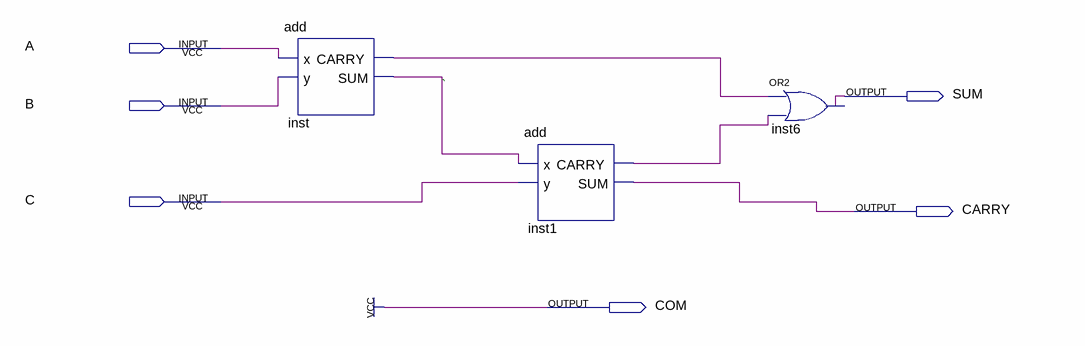
[diagram p0: schematic sheet]
// Quartus schematic full_adder.bdf as structural Verilog: 3 symbols, 6 pins
module full_adder (
  input  A,
  input  B,
  input  C,
  output SUM,
  output CARRY,
  output COM
);

  wire inst1_carry, inst_carry, inst_sum;

  add inst (.x(A), .y(B), .CARRY(inst_carry), .SUM(inst_sum));
  add inst1 (.x(inst_sum), .y(C), .CARRY(inst1_carry), .SUM(CARRY));
  or inst6 (SUM, inst_carry, inst1_carry);

  assign COM = 1'b1;

  // Notes on the sheet:
  //   `
endmodule
